# EasyEDA schematic schematic.json
REV: 1.0; Date: 2024-09-27; Sheet: 1/1; Drawn By: Akul
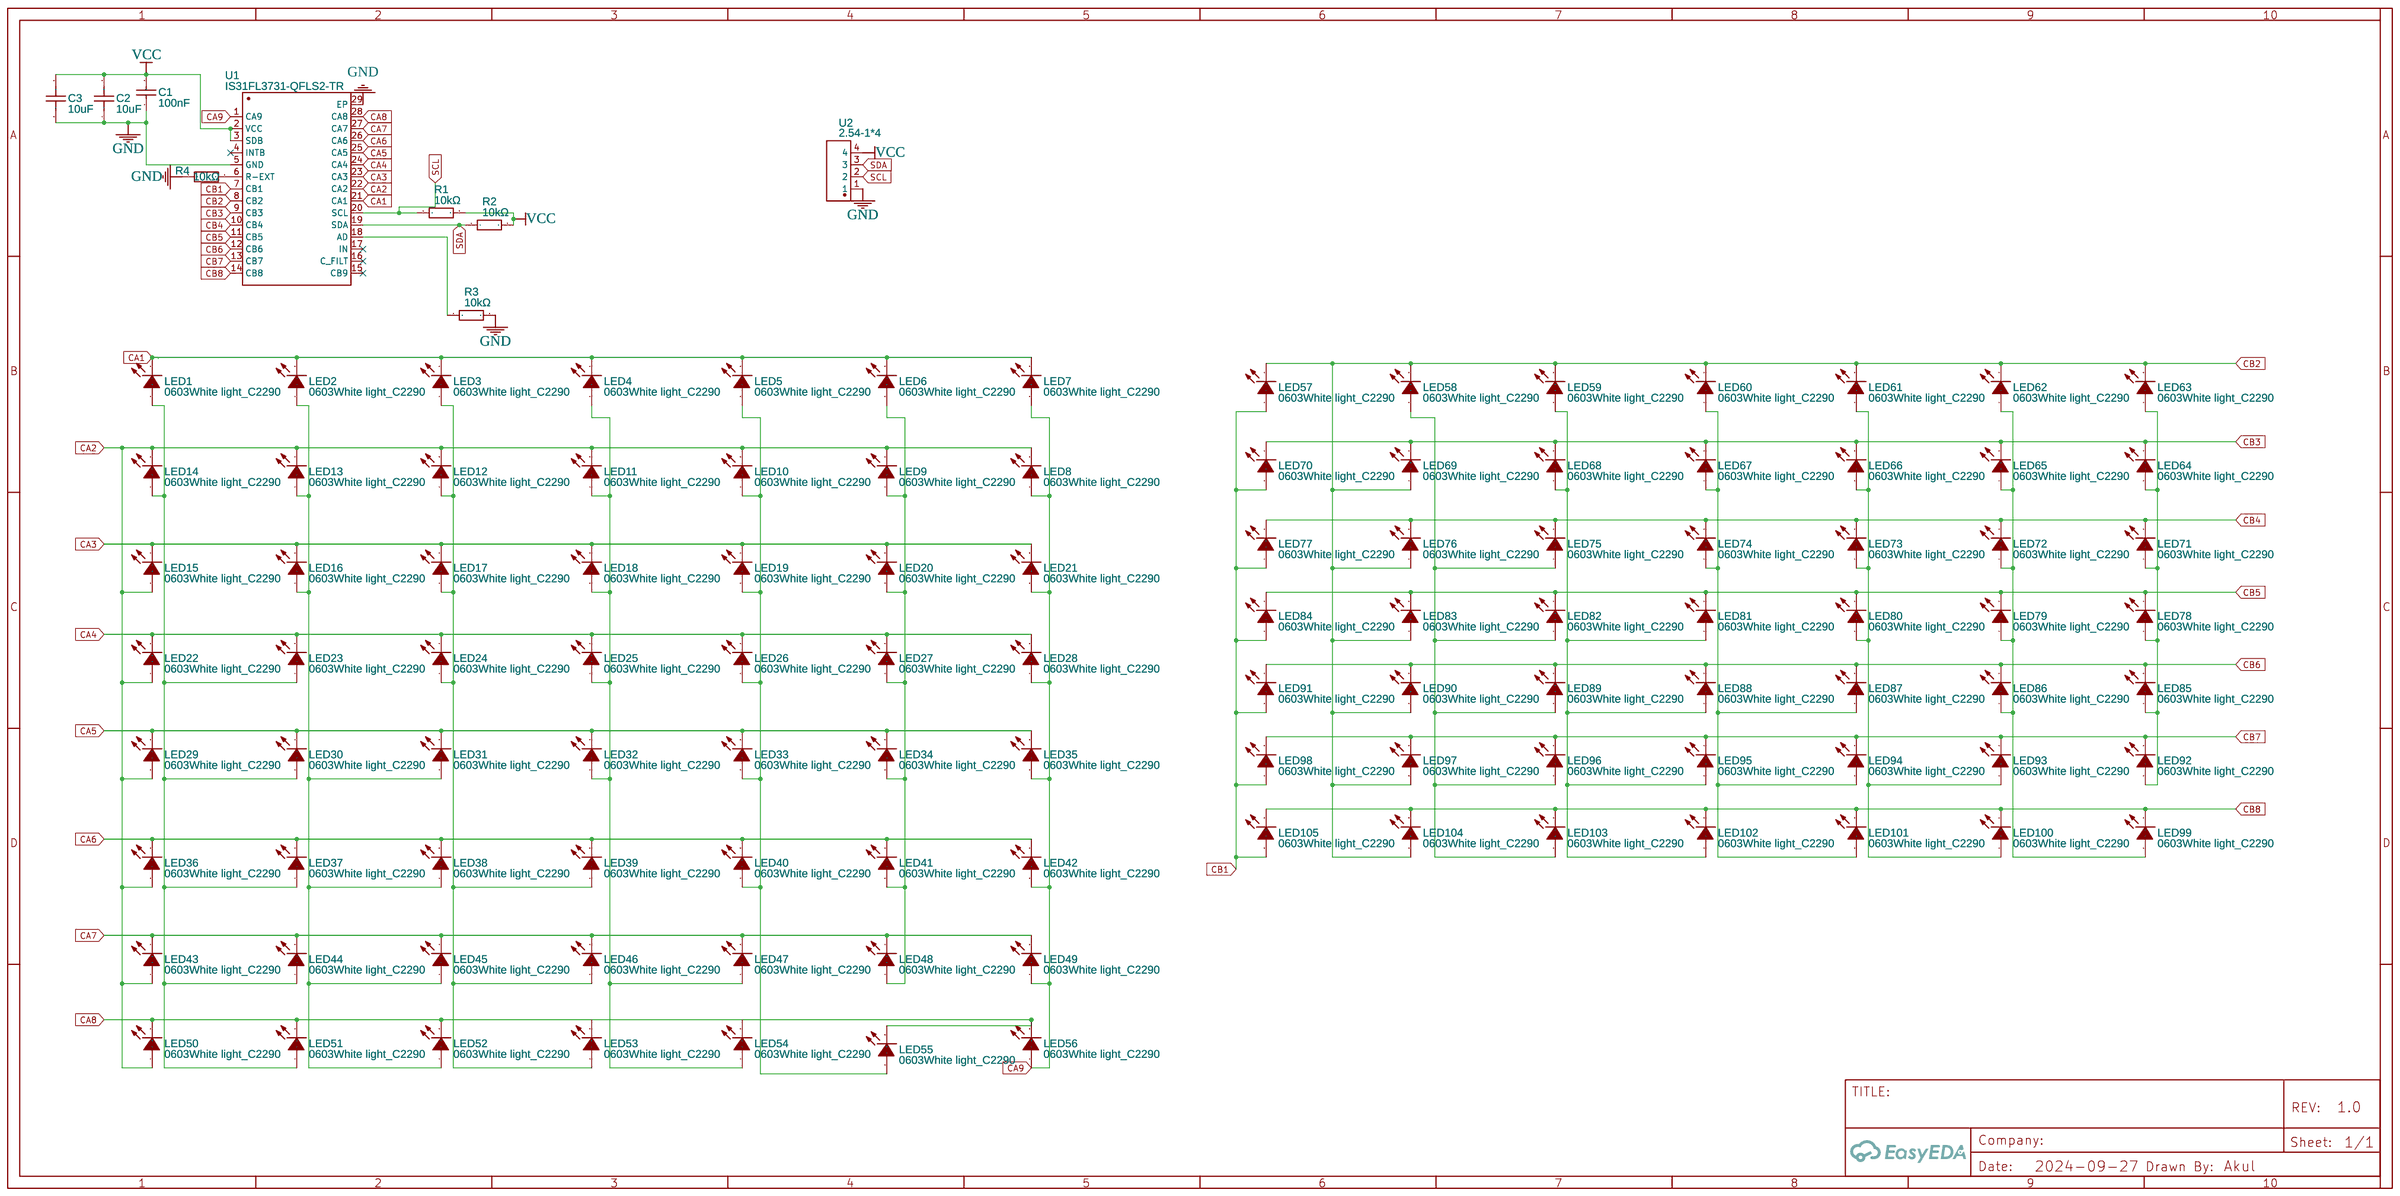
[diagram p0: schematic sheet]

## Parts
C1  100nF  [C0402]
C2  10uF  [C0603]
C3  10uF  [C0603]
LED1  0603White light_C2290  [LED0603-R-RD_WHITE]
LED2  0603White light_C2290  [LED0603-R-RD_WHITE]
LED3  0603White light_C2290  [LED0603-R-RD_WHITE]
LED4  0603White light_C2290  [LED0603-R-RD_WHITE]
LED5  0603White light_C2290  [LED0603-R-RD_WHITE]
LED6  0603White light_C2290  [LED0603-R-RD_WHITE]
LED7  0603White light_C2290  [LED0603-R-RD_WHITE]
LED8  0603White light_C2290  [LED0603-R-RD_WHITE]
LED9  0603White light_C2290  [LED0603-R-RD_WHITE]
LED10  0603White light_C2290  [LED0603-R-RD_WHITE]
LED11  0603White light_C2290  [LED0603-R-RD_WHITE]
LED12  0603White light_C2290  [LED0603-R-RD_WHITE]
LED13  0603White light_C2290  [LED0603-R-RD_WHITE]
LED14  0603White light_C2290  [LED0603-R-RD_WHITE]
LED15  0603White light_C2290  [LED0603-R-RD_WHITE]
LED16  0603White light_C2290  [LED0603-R-RD_WHITE]
LED17  0603White light_C2290  [LED0603-R-RD_WHITE]
LED18  0603White light_C2290  [LED0603-R-RD_WHITE]
LED19  0603White light_C2290  [LED0603-R-RD_WHITE]
LED20  0603White light_C2290  [LED0603-R-RD_WHITE]
LED21  0603White light_C2290  [LED0603-R-RD_WHITE]
LED22  0603White light_C2290  [LED0603-R-RD_WHITE]
LED23  0603White light_C2290  [LED0603-R-RD_WHITE]
LED24  0603White light_C2290  [LED0603-R-RD_WHITE]
LED25  0603White light_C2290  [LED0603-R-RD_WHITE]
LED26  0603White light_C2290  [LED0603-R-RD_WHITE]
LED27  0603White light_C2290  [LED0603-R-RD_WHITE]
LED28  0603White light_C2290  [LED0603-R-RD_WHITE]
LED29  0603White light_C2290  [LED0603-R-RD_WHITE]
LED30  0603White light_C2290  [LED0603-R-RD_WHITE]
LED31  0603White light_C2290  [LED0603-R-RD_WHITE]
LED32  0603White light_C2290  [LED0603-R-RD_WHITE]
LED33  0603White light_C2290  [LED0603-R-RD_WHITE]
LED34  0603White light_C2290  [LED0603-R-RD_WHITE]
LED35  0603White light_C2290  [LED0603-R-RD_WHITE]
LED36  0603White light_C2290  [LED0603-R-RD_WHITE]
LED37  0603White light_C2290  [LED0603-R-RD_WHITE]
LED38  0603White light_C2290  [LED0603-R-RD_WHITE]
LED39  0603White light_C2290  [LED0603-R-RD_WHITE]
LED40  0603White light_C2290  [LED0603-R-RD_WHITE]
LED41  0603White light_C2290  [LED0603-R-RD_WHITE]
LED42  0603White light_C2290  [LED0603-R-RD_WHITE]
LED43  0603White light_C2290  [LED0603-R-RD_WHITE]
LED44  0603White light_C2290  [LED0603-R-RD_WHITE]
LED45  0603White light_C2290  [LED0603-R-RD_WHITE]
LED46  0603White light_C2290  [LED0603-R-RD_WHITE]
LED47  0603White light_C2290  [LED0603-R-RD_WHITE]
LED48  0603White light_C2290  [LED0603-R-RD_WHITE]
LED49  0603White light_C2290  [LED0603-R-RD_WHITE]
LED50  0603White light_C2290  [LED0603-R-RD_WHITE]
LED51  0603White light_C2290  [LED0603-R-RD_WHITE]
LED52  0603White light_C2290  [LED0603-R-RD_WHITE]
LED53  0603White light_C2290  [LED0603-R-RD_WHITE]
LED54  0603White light_C2290  [LED0603-R-RD_WHITE]
LED55  0603White light_C2290  [LED0603-R-RD_WHITE]
LED56  0603White light_C2290  [LED0603-R-RD_WHITE]
LED57  0603White light_C2290  [LED0603-R-RD_WHITE]
LED58  0603White light_C2290  [LED0603-R-RD_WHITE]
LED59  0603White light_C2290  [LED0603-R-RD_WHITE]
LED60  0603White light_C2290  [LED0603-R-RD_WHITE]
LED61  0603White light_C2290  [LED0603-R-RD_WHITE]
LED62  0603White light_C2290  [LED0603-R-RD_WHITE]
LED63  0603White light_C2290  [LED0603-R-RD_WHITE]
LED64  0603White light_C2290  [LED0603-R-RD_WHITE]
LED65  0603White light_C2290  [LED0603-R-RD_WHITE]
LED66  0603White light_C2290  [LED0603-R-RD_WHITE]
LED67  0603White light_C2290  [LED0603-R-RD_WHITE]
LED68  0603White light_C2290  [LED0603-R-RD_WHITE]
LED69  0603White light_C2290  [LED0603-R-RD_WHITE]
LED70  0603White light_C2290  [LED0603-R-RD_WHITE]
LED71  0603White light_C2290  [LED0603-R-RD_WHITE]
LED72  0603White light_C2290  [LED0603-R-RD_WHITE]
LED73  0603White light_C2290  [LED0603-R-RD_WHITE]
LED74  0603White light_C2290  [LED0603-R-RD_WHITE]
LED75  0603White light_C2290  [LED0603-R-RD_WHITE]
LED76  0603White light_C2290  [LED0603-R-RD_WHITE]
LED77  0603White light_C2290  [LED0603-R-RD_WHITE]
LED78  0603White light_C2290  [LED0603-R-RD_WHITE]
LED79  0603White light_C2290  [LED0603-R-RD_WHITE]
LED80  0603White light_C2290  [LED0603-R-RD_WHITE]
LED81  0603White light_C2290  [LED0603-R-RD_WHITE]
LED82  0603White light_C2290  [LED0603-R-RD_WHITE]
LED83  0603White light_C2290  [LED0603-R-RD_WHITE]
LED84  0603White light_C2290  [LED0603-R-RD_WHITE]
LED85  0603White light_C2290  [LED0603-R-RD_WHITE]
LED86  0603White light_C2290  [LED0603-R-RD_WHITE]
LED87  0603White light_C2290  [LED0603-R-RD_WHITE]
LED88  0603White light_C2290  [LED0603-R-RD_WHITE]
LED89  0603White light_C2290  [LED0603-R-RD_WHITE]
LED90  0603White light_C2290  [LED0603-R-RD_WHITE]
LED91  0603White light_C2290  [LED0603-R-RD_WHITE]
LED92  0603White light_C2290  [LED0603-R-RD_WHITE]
LED93  0603White light_C2290  [LED0603-R-RD_WHITE]
LED94  0603White light_C2290  [LED0603-R-RD_WHITE]
LED95  0603White light_C2290  [LED0603-R-RD_WHITE]
LED96  0603White light_C2290  [LED0603-R-RD_WHITE]
LED97  0603White light_C2290  [LED0603-R-RD_WHITE]
LED98  0603White light_C2290  [LED0603-R-RD_WHITE]
LED99  0603White light_C2290  [LED0603-R-RD_WHITE]
LED100  0603White light_C2290  [LED0603-R-RD_WHITE]
LED101  0603White light_C2290  [LED0603-R-RD_WHITE]
LED102  0603White light_C2290  [LED0603-R-RD_WHITE]
LED103  0603White light_C2290  [LED0603-R-RD_WHITE]
LED104  0603White light_C2290  [LED0603-R-RD_WHITE]
LED105  0603White light_C2290  [LED0603-R-RD_WHITE]
R1  10kΩ  [R0402]
R2  10kΩ  [R0402]
R3  10kΩ  [R0402]
R4  10kΩ  [R0402]
U1  IS31FL3731-QFLS2-TR  [QFN-28_L4.0-W4.0-P0.40-BL-EP]
U2  2.54-1*4  [HDR-TH_4P-P2.54-V-M-1]

## Library data of the parts
C1 = CL05B104KO5NNNC: Supplier: LCSC; Manufacturer: SAMSUNG(三星); Supplier Part: C1525; JLCPCB Part Class: Basic Part
C2 C3 = CL10A106KP8NNNC: Supplier: LCSC; Manufacturer: SAMSUNG(三星); Supplier Part: C19702; JLCPCB Part Class: Basic Part
LED1-LED105 = 0603White light_C2290: Supplier: LCSC; Manufacturer: KENTO; Manufacturer Part: KT-0603白灯; Supplier Part: C2290; JLCPCB Part Class: Basic Part
R1-R4 = 0402WGF1002TCE: Supplier: LCSC; Manufacturer: UNI-ROYAL(厚声); Supplier Part: C25744; JLCPCB Part Class: Basic Part
U1 = IS31FL3731-QFLS2-TR: Contributor: LCSC; Supplier: LCSC; Supplier Part: C191206; Manufacturer: ISSI(美国芯成); JLCPCB Part Class: Extended Part
U2 = 2.54-1*4: Supplier: LCSC; Supplier Part: C5116483; Manufacturer: ZHOURI(洲日); JLCPCB Part Class: Extended Part; Contributor: lcsc

## Nets
GND: C1.1 C2.1 C3.1 R3.2 R4.1 U1.5(GND) U1.29(EP) U2.1
VCC: C1.2 C2.2 C3.2 R1.2 R2.2 U1.2(VCC) U1.3(SDB) U2.4
CA1: LED1.2(K) LED2.2(K) LED3.2(K) LED4.2(K) LED5.2(K) LED6.2(K) LED7.2(K) U1.21(CA1)
CA2: LED8.2(K) LED9.2(K) LED10.2(K) LED11.2(K) LED12.2(K) LED13.2(K) LED14.2(K) LED15.1(A) LED22.1(A) LED29.1(A) LED36.1(A) LED43.1(A) LED50.1(A) U1.22(CA2)
CA3: LED15.2(K) LED16.2(K) LED17.2(K) LED18.2(K) LED19.2(K) LED20.2(K) LED21.2(K) U1.23(CA3)
CA4: LED22.2(K) LED23.2(K) LED24.2(K) LED25.2(K) LED26.2(K) LED27.2(K) LED28.2(K) U1.24(CA4)
CA5: LED29.2(K) LED30.2(K) LED31.2(K) LED32.2(K) LED33.2(K) LED34.2(K) LED35.2(K) U1.25(CA5)
CA6: LED36.2(K) LED37.2(K) LED38.2(K) LED39.2(K) LED40.2(K) LED41.2(K) LED42.2(K) U1.26(CA6)
CA7: LED43.2(K) LED44.2(K) LED45.2(K) LED46.2(K) LED47.2(K) LED48.2(K) LED49.2(K) U1.27(CA7)
CA8: LED50.2(K) LED51.2(K) LED52.2(K) LED53.2(K) LED54.2(K) LED55.2(K) LED56.2(K) U1.28(CA8)
CA9: LED7.1(A) LED8.1(A) LED21.1(A) LED28.1(A) LED35.1(A) LED42.1(A) LED49.1(A) LED56.1(A) U1.1(CA9)
CB1: LED57.1(A) LED70.1(A) LED77.1(A) LED84.1(A) LED91.1(A) LED98.1(A) LED105.1(A) U1.7(CB1)
CB2: LED57.2(K) LED58.2(K) LED59.2(K) LED60.2(K) LED61.2(K) LED62.2(K) LED63.2(K) LED69.1(A) LED76.1(A) LED83.1(A) LED90.1(A) LED97.1(A) LED104.1(A) U1.8(CB2)
CB3: LED64.2(K) LED65.2(K) LED66.2(K) LED67.2(K) LED68.2(K) LED69.2(K) LED70.2(K) U1.9(CB3)
CB4: LED71.2(K) LED72.2(K) LED73.2(K) LED74.2(K) LED75.2(K) LED76.2(K) LED77.2(K) U1.10(CB4)
CB5: LED78.2(K) LED79.2(K) LED80.2(K) LED81.2(K) LED82.2(K) LED83.2(K) LED84.2(K) U1.11(CB5)
CB6: LED85.2(K) LED86.2(K) LED87.2(K) LED88.2(K) LED89.2(K) LED90.2(K) LED91.2(K) U1.12(CB6)
CB7: LED92.2(K) LED93.2(K) LED94.2(K) LED95.2(K) LED96.2(K) LED97.2(K) LED98.2(K) U1.13(CB7)
CB8: LED99.2(K) LED100.2(K) LED101.2(K) LED102.2(K) LED103.2(K) LED104.2(K) LED105.2(K) U1.14(CB8)
SCL: R1.1 U1.20(SCL) U2.2
SDA: R2.1 U1.19(SDA) U2.3
Net-(LED1-1): LED1.1(A) LED14.1(A) LED23.1(A) LED30.1(A) LED37.1(A) LED44.1(A) LED51.1(A)
Net-(LED2-1): LED2.1(A) LED13.1(A) LED16.1(A) LED31.1(A) LED38.1(A) LED45.1(A) LED52.1(A)
Net-(LED3-1): LED3.1(A) LED12.1(A) LED17.1(A) LED24.1(A) LED39.1(A) LED46.1(A) LED53.1(A)
Net-(LED4-1): LED4.1(A) LED11.1(A) LED18.1(A) LED25.1(A) LED32.1(A) LED47.1(A) LED54.1(A)
Net-(LED5-1): LED5.1(A) LED10.1(A) LED19.1(A) LED26.1(A) LED33.1(A) LED40.1(A) LED55.1(A)
Net-(LED6-1): LED6.1(A) LED9.1(A) LED20.1(A) LED27.1(A) LED34.1(A) LED41.1(A) LED48.1(A)
Net-(LED58-1): LED58.1(A) LED75.1(A) LED82.1(A) LED89.1(A) LED96.1(A) LED103.1(A)
Net-(LED59-1): LED59.1(A) LED68.1(A) LED81.1(A) LED88.1(A) LED95.1(A) LED102.1(A)
Net-(LED60-1): LED60.1(A) LED67.1(A) LED74.1(A) LED87.1(A) LED94.1(A) LED101.1(A)
Net-(LED61-1): LED61.1(A) LED66.1(A) LED73.1(A) LED80.1(A) LED93.1(A) LED100.1(A)
Net-(LED62-1): LED62.1(A) LED65.1(A) LED72.1(A) LED79.1(A) LED86.1(A) LED99.1(A)
Net-(LED63-1): LED63.1(A) LED64.1(A) LED71.1(A) LED78.1(A) LED85.1(A) LED92.1(A)
Net-(R3-1): R3.1 U1.18(AD)
Net-(R4-2): R4.2 U1.6(R-EXT)

Not connected (* = marked no-connect by the designer): U1 4(INTB)* 15(CB9)* 16(C_FILT)* 17(IN)*
